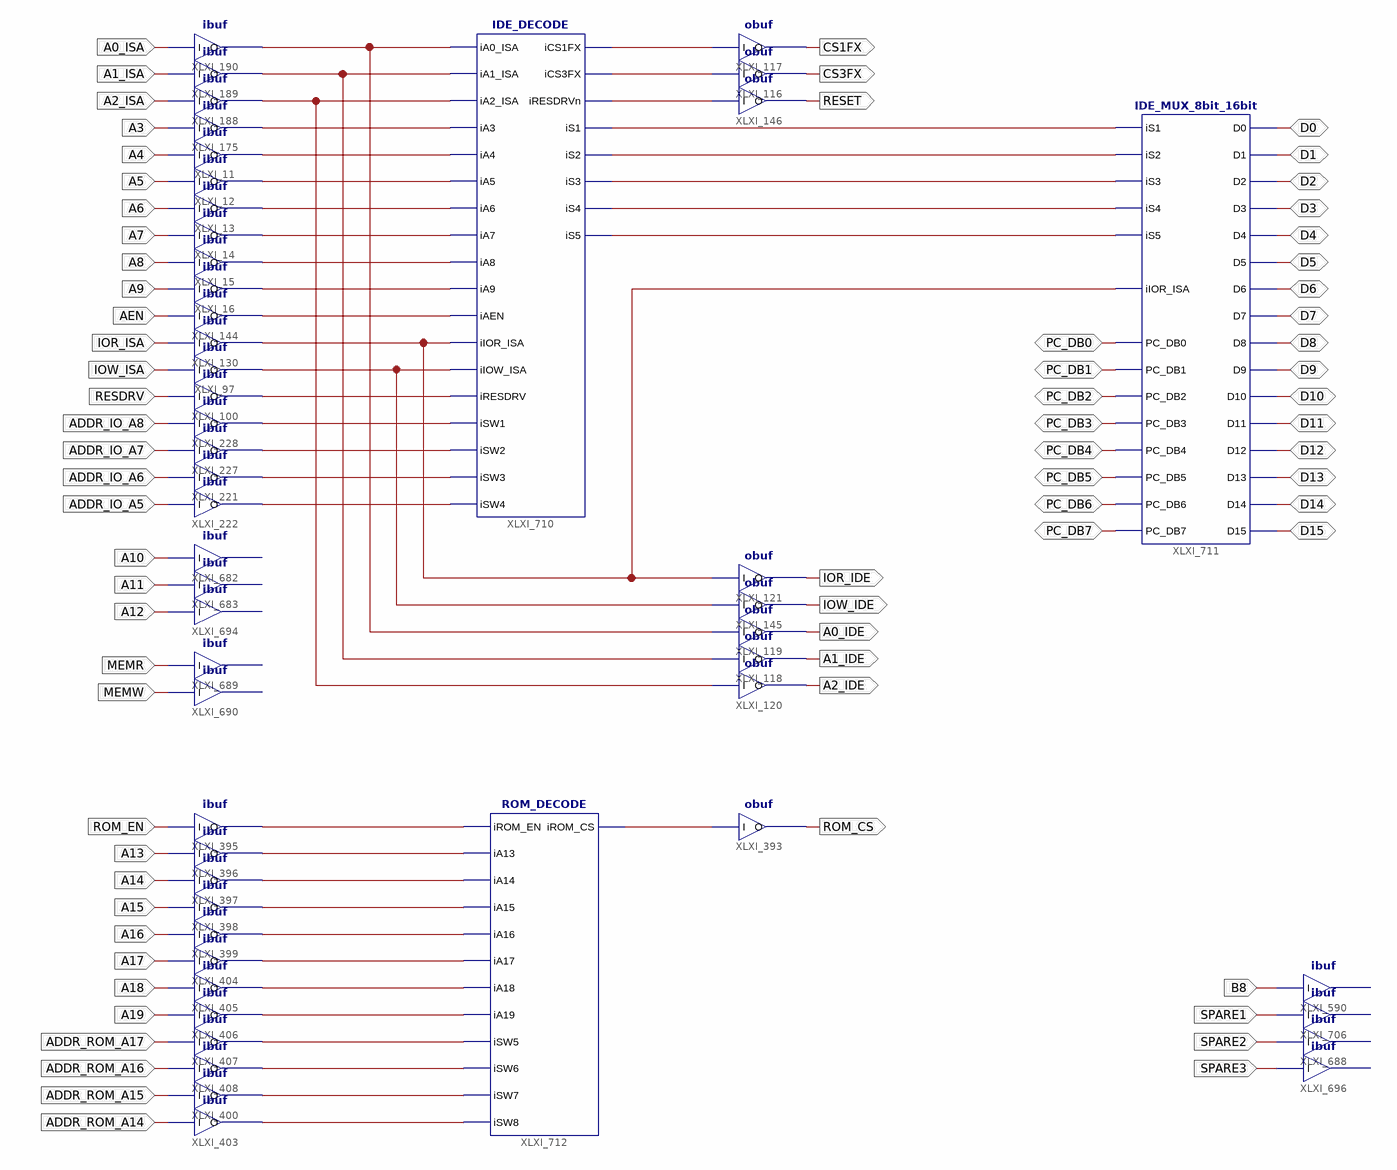
[diagram p0: schematic sheet 1]
// Xilinx ISE schematic Top.sch (xc9500xl) as structural Verilog: 51 symbols, 72 ports
module Top (
  input  RESDRV,
  input  IOW_ISA,
  input  IOR_ISA,
  input  AEN,
  input  A4,
  input  A5,
  input  A6,
  input  A7,
  input  A8,
  input  A9,
  input  A3,
  input  A0_ISA,
  input  A1_ISA,
  input  A2_ISA,
  input  ADDR_IO_A8,
  input  ADDR_IO_A7,
  input  ADDR_IO_A6,
  input  ADDR_IO_A5,
  input  ROM_EN,
  input  B8,
  input  A13,
  input  A14,
  input  A15,
  input  A16,
  input  A17,
  input  A18,
  input  A19,
  input  ADDR_ROM_A17,
  input  ADDR_ROM_A16,
  input  ADDR_ROM_A15,
  input  ADDR_ROM_A14,
  input  A10,
  input  A11,
  input  A12,
  input  MEMW,
  input  MEMR,
  input  SPARE2,
  input  SPARE3,
  input  SPARE1,
  inout  D0,
  inout  D1,
  inout  D2,
  inout  D3,
  inout  D4,
  inout  D5,
  inout  D6,
  inout  D7,
  inout  D8,
  inout  D9,
  inout  D10,
  inout  D11,
  inout  D12,
  inout  D13,
  inout  D14,
  inout  D15,
  inout  PC_DB7,
  inout  PC_DB6,
  inout  PC_DB5,
  inout  PC_DB4,
  inout  PC_DB3,
  inout  PC_DB2,
  inout  PC_DB1,
  inout  PC_DB0,
  output A1_IDE,
  output A0_IDE,
  output A2_IDE,
  output IOR_IDE,
  output IOW_IDE,
  output CS3FX,
  output CS1FX,
  output RESET,
  output ROM_CS
);

  wire iA0_ISA, iA1_ISA, iA2_ISA, iA3, iA4, iA5, iA6, iA7, iA8, iA9, iAEN, iCS1FX, iCS3FX, iIOR_ISA,
       iIOW_ISA, iRESDRV, iRESDRVn, iS1, iS2, iS3, iS4, iS5, iSW1, iSW2, iSW3, iSW4, XLXN_101, XLXN_120,
       XLXN_121, XLXN_122, XLXN_123, XLXN_124, XLXN_125, XLXN_127, XLXN_128, XLXN_131, XLXN_624, XLXN_625,
       XLXN_626;

  ibuf XLXI_190 (.I(A0_ISA), .O(iA0_ISA));
  ibuf XLXI_189 (.I(A1_ISA), .O(iA1_ISA));
  ibuf XLXI_188 (.I(A2_ISA), .O(iA2_ISA));
  ibuf XLXI_175 (.I(A3), .O(iA3));
  ibuf XLXI_11 (.I(A4), .O(iA4));
  ibuf XLXI_144 (.I(AEN), .O(iAEN));
  ibuf XLXI_100 (.I(RESDRV), .O(iRESDRV));
  ibuf XLXI_97 (.I(IOW_ISA), .O(iIOW_ISA));
  ibuf XLXI_130 (.I(IOR_ISA), .O(iIOR_ISA));
  ibuf XLXI_12 (.I(A5), .O(iA5));
  ibuf XLXI_13 (.I(A6), .O(iA6));
  ibuf XLXI_14 (.I(A7), .O(iA7));
  ibuf XLXI_15 (.I(A8), .O(iA8));
  ibuf XLXI_16 (.I(A9), .O(iA9));
  ibuf XLXI_228 (.I(ADDR_IO_A8), .O(iSW1));
  ibuf XLXI_227 (.I(ADDR_IO_A7), .O(iSW2));
  ibuf XLXI_221 (.I(ADDR_IO_A6), .O(iSW3));
  ibuf XLXI_222 (.I(ADDR_IO_A5), .O(iSW4));
  obuf XLXI_120 (.I(iA2_ISA), .O(A2_IDE));
  obuf XLXI_118 (.I(iA1_ISA), .O(A1_IDE));
  obuf XLXI_119 (.I(iA0_ISA), .O(A0_IDE));
  obuf XLXI_145 (.I(iIOW_ISA), .O(IOW_IDE));
  obuf XLXI_121 (.I(iIOR_ISA), .O(IOR_IDE));
  obuf XLXI_116 (.I(iCS3FX), .O(CS3FX));
  obuf XLXI_117 (.I(iCS1FX), .O(CS1FX));
  obuf XLXI_146 (.I(iRESDRVn), .O(RESET));
  obuf XLXI_393 (.I(XLXN_101), .O(ROM_CS));
  ibuf XLXI_395 (.I(ROM_EN), .O(XLXN_120));
  ibuf XLXI_590 (.I(B8));  // open: O
  ibuf XLXI_396 (.I(A13), .O(XLXN_121));
  ibuf XLXI_397 (.I(A14), .O(XLXN_122));
  ibuf XLXI_398 (.I(A15), .O(XLXN_123));
  ibuf XLXI_399 (.I(A16), .O(XLXN_124));
  ibuf XLXI_404 (.I(A17), .O(XLXN_125));
  ibuf XLXI_405 (.I(A18), .O(XLXN_626));
  ibuf XLXI_406 (.I(A19), .O(XLXN_127));
  ibuf XLXI_407 (.I(ADDR_ROM_A17), .O(XLXN_128));
  ibuf XLXI_408 (.I(ADDR_ROM_A16), .O(XLXN_625));
  ibuf XLXI_400 (.I(ADDR_ROM_A15), .O(XLXN_624));
  ibuf XLXI_403 (.I(ADDR_ROM_A14), .O(XLXN_131));
  ibuf XLXI_683 (.I(A11));  // open: O
  ibuf XLXI_682 (.I(A10));  // open: O
  ibuf XLXI_694 (.I(A12));  // open: O
  ibuf XLXI_689 (.I(MEMR));  // open: O
  ibuf XLXI_690 (.I(MEMW));  // open: O
  ibuf XLXI_688 (.I(SPARE2));  // open: O
  ibuf XLXI_696 (.I(SPARE3));  // open: O
  ibuf XLXI_706 (.I(SPARE1));  // open: O
  IDE_DECODE XLXI_710 (
    .iA0_ISA(iA0_ISA), .iA1_ISA(iA1_ISA), .iA2_ISA(iA2_ISA), .iA3(iA3), .iA4(iA4), .iA5(iA5), .iA6(iA6),
    .iA7(iA7), .iA8(iA8), .iA9(iA9), .iAEN(iAEN), .iCS1FX(iCS1FX), .iCS3FX(iCS3FX), .iIOR_ISA(iIOR_ISA),
    .iIOW_ISA(iIOW_ISA), .iRESDRV(iRESDRV), .iRESDRVn(iRESDRVn), .iS1(iS1), .iS2(iS2), .iS3(iS3), .iS4(iS4),
    .iS5(iS5), .iSW1(iSW1), .iSW2(iSW2), .iSW3(iSW3), .iSW4(iSW4));
  IDE_MUX_8bit_16bit XLXI_711 (
    .PC_DB0(PC_DB0), .PC_DB1(PC_DB1), .PC_DB2(PC_DB2), .PC_DB3(PC_DB3), .PC_DB4(PC_DB4), .PC_DB5(PC_DB5),
    .PC_DB6(PC_DB6), .PC_DB7(PC_DB7), .D0(D0), .D1(D1), .D2(D2), .D3(D3), .D4(D4), .D5(D5), .D6(D6), .D7(D7),
    .D8(D8), .D9(D9), .D10(D10), .D11(D11), .D12(D12), .D13(D13), .D14(D14), .D15(D15), .iS1(iS1), .iS2(iS2),
    .iS3(iS3), .iS4(iS4), .iS5(iS5), .iIOR_ISA(iIOR_ISA));
  ROM_DECODE XLXI_712 (
    .iROM_CS(XLXN_101), .iROM_EN(XLXN_120), .iA13(XLXN_121), .iA14(XLXN_122), .iA15(XLXN_123),
    .iA16(XLXN_124), .iA17(XLXN_125), .iA18(XLXN_626), .iA19(XLXN_127), .iSW5(XLXN_128), .iSW6(XLXN_625),
    .iSW7(XLXN_624), .iSW8(XLXN_131));
endmodule
